# EAGLE schematic GuageSchematic (EAGLE 9.7.0)
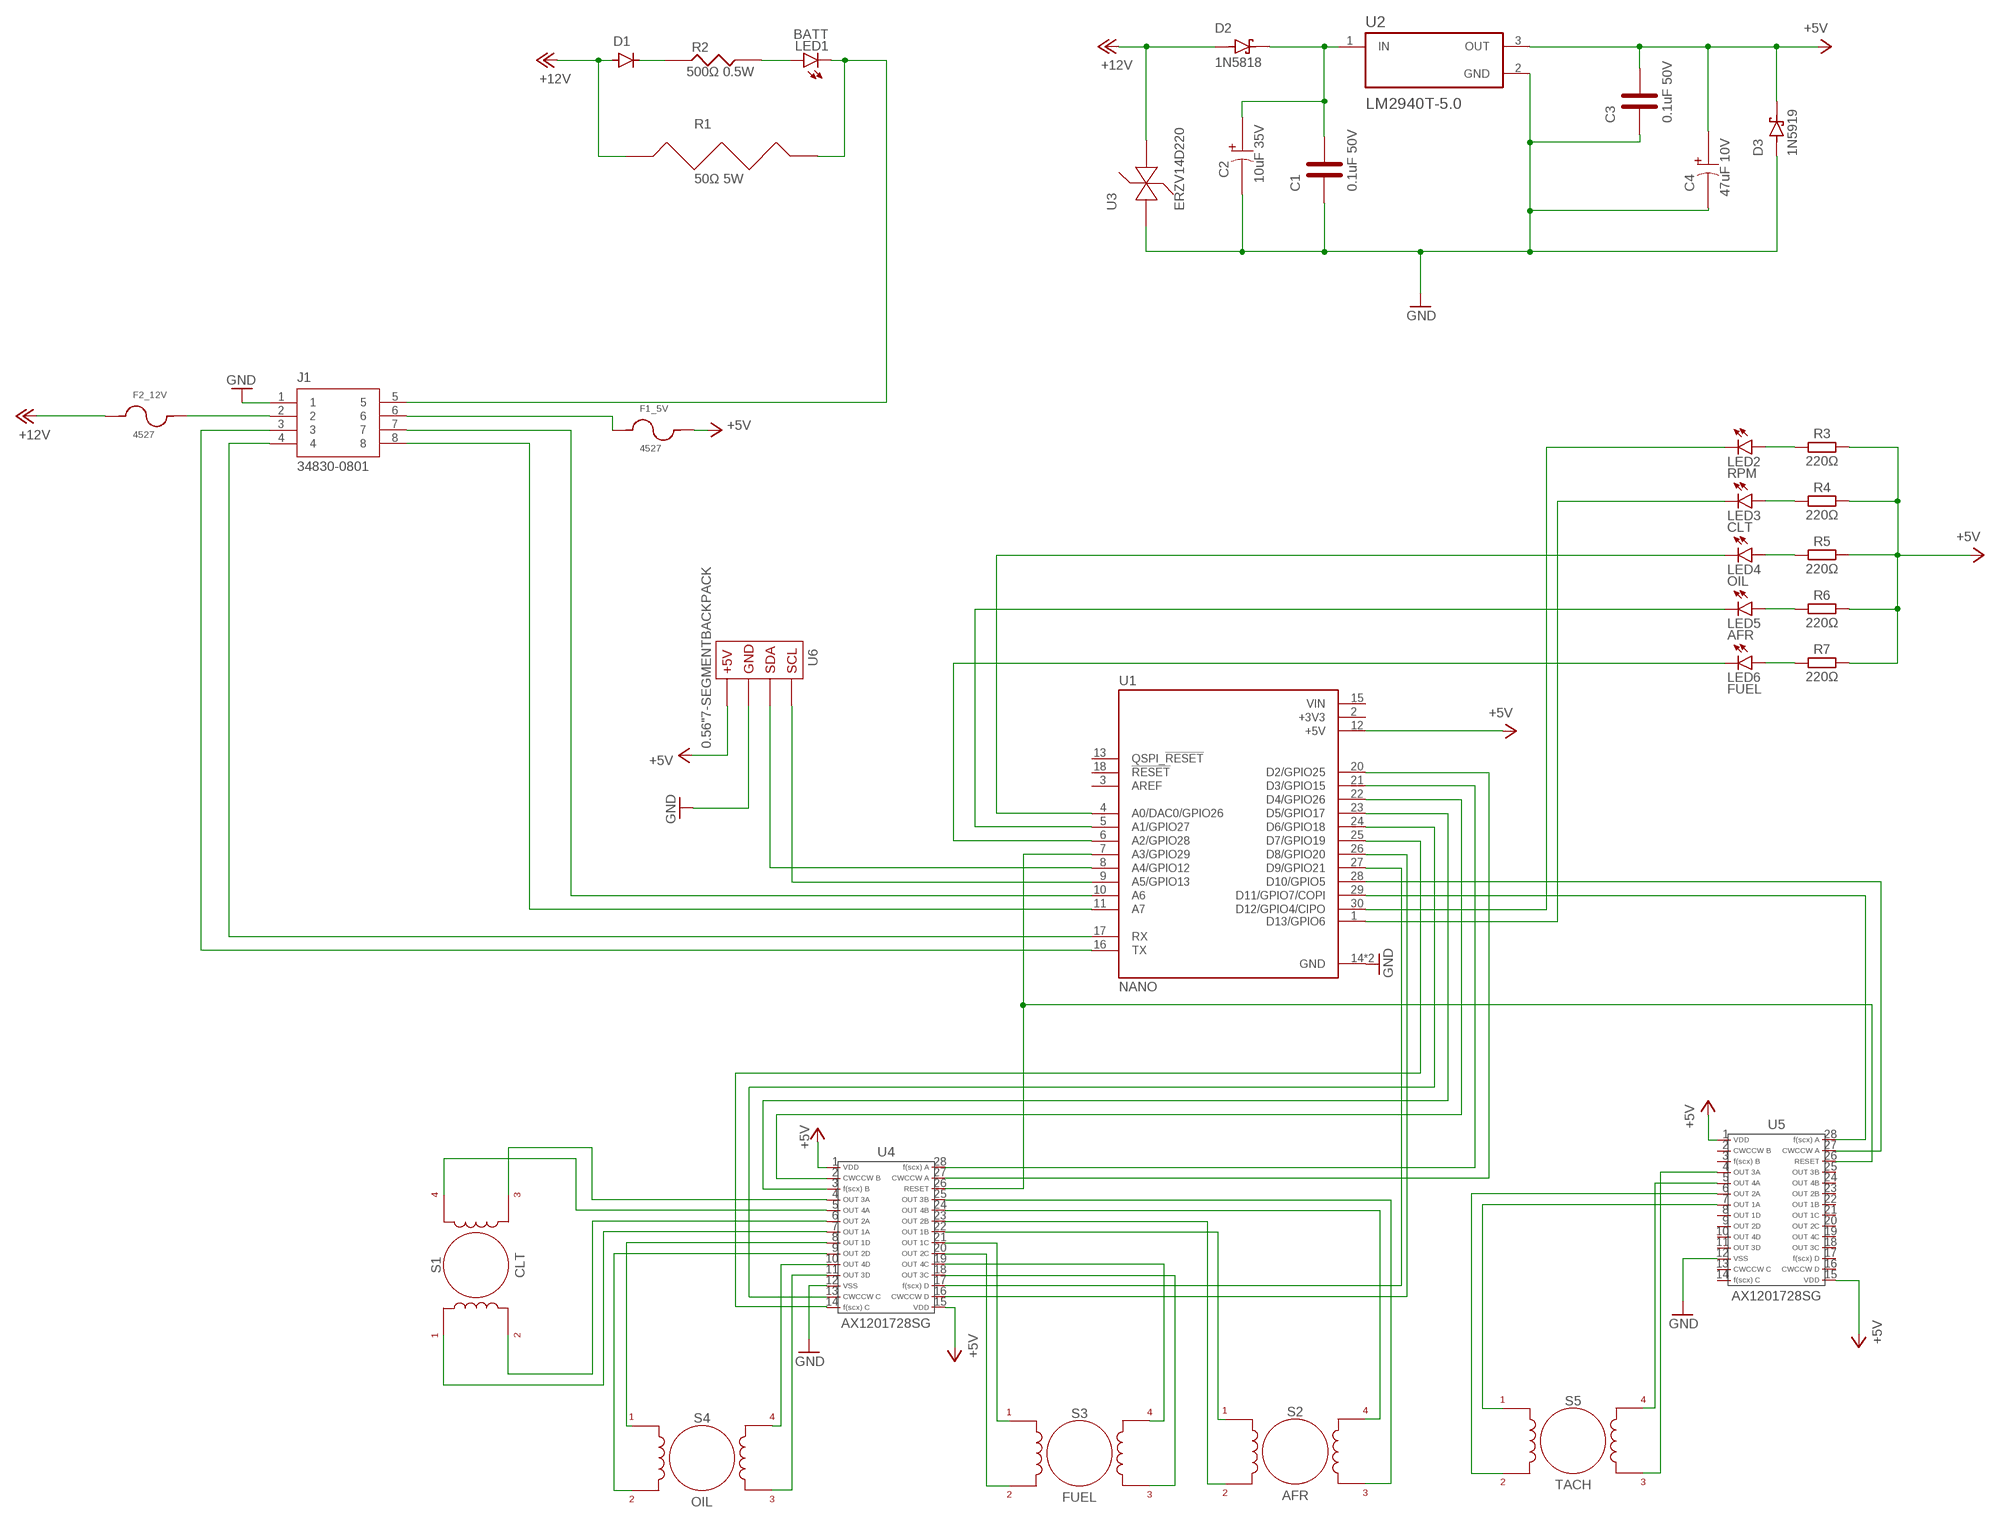
[diagram p0: schematic, sheet 1]

## Parts
C1  0.1uF 50V  C322C104K5R5TA  [C322C104K5R5TA]
C2  10uF 35V  T356G106K035AT  [T356G106K035AT]
C3  0.1uF 50V  C322C104K5R5TA  [C322C104K5R5TA]
C4  47uF 10V  TAP476K006CCS  [TAP476K006CCS]
D1  1N4004  [DO-41]
D2  1N5818  [DIOAD1036W78L520D271]
D3  1N5919  1N5818  [DIOAD1036W78L520D271]
F1_5V  4527  [4527]
F2_12V  4527  [4527]
J1  34830-0801  [MOLEX_34830-0801]
LED1  BATT  LED5MM  [LED5MM]
LED2  RPM  LED5MM  [LED5MM]
LED3  CLT  LED5MM  [LED5MM]
LED4  OIL  LED5MM  [LED5MM]
LED5  AFR  LED5MM  [LED5MM]
LED6  FUEL  LED5MM  [LED5MM]
R1  50Ω 5W  25J50RE  [25J50RE]
R2  500Ω 0.5W  CMF55  [CMF55]
R3  220Ω  R_AXIAL-7.2MM-PITCH  [RESAD724W46L381D178B]
R4  220Ω  R_AXIAL-7.2MM-PITCH  [RESAD724W46L381D178B]
R5  220Ω  R_AXIAL-7.2MM-PITCH  [RESAD724W46L381D178B]
R6  220Ω  R_AXIAL-7.2MM-PITCH  [RESAD724W46L381D178B]
R7  220Ω  R_AXIAL-7.2MM-PITCH  [RESAD724W46L381D178B]
S1  CLT  X27.168  [X27.168]
S2  AFR  X27.168  [X27.168]
S3  FUEL  X27.168  [X27.168]
S4  OIL  X27.168  [X27.168]
S5  TACH  X27.168  [X27.168]
U1  NANO  ABX00053  [MODULE_ABX00053]
U2  LM2940T-5.0  [TO254P1054X470X1955-3]
U3  ERZV14D220  [ERZV14D220]
U4  AX1201728SG  [AX1201728SG]
U5  AX1201728SG  [AX1201728SG]
U6  0.56"7-SEGMENTBACKPACK  [0.56"7-SEGMENTBACKPACK]

## Nets
+5V: C3.2 C4.1 D3.K F1_5V.2 R3.2 R4.2 R5.2 R6.2 R7.2 U1.12(+5V) U2.3(OUT) U4.1 U4.15 U5.1 U5.15 U6.P$4
+12V: D1.A D2.A F2_12V.1 R1.1 U3.2
GND: C1.1 C2.2 C3.1 C4.2 D3.A J1.1 U1.14(GND) U1.19(GND) U2.2(GND) U3.1 U4.12 U5.12 U6.P$3
N$1: J1.3 U1.16(TX)
N$2: J1.4 U1.17(RX)
N$3: J1.7 U1.10(A6)
N$4: J1.8 U1.11(A7)
N$5: D1.C R2.1
N$6: LED1.A R2.2
N$7: J1.5 LED1.K(C) R1.2
N$8: C1.2 C2.1 D2.K U2.1(IN)
N$9: F1_5V.1 J1.6
N$10: F2_12V.2 J1.2
N$11: U1.7(A3/GPIO29) U4.26 U5.26
N$12: U1.20(D2/GPIO25) U4.27
N$13: U1.21(D3/GPIO15) U4.28
N$14: U1.22(D4/GPIO26) U4.2
N$15: U1.23(D5/GPIO17) U4.3
N$16: U1.24(D6/GPIO18) U4.13
N$17: U1.25(D7/GPIO19) U4.14
N$18: U1.26(D8/GPIO20) U4.16
N$19: U1.27(D9/GPIO21) U4.17
N$20: U1.28(D10/GPIO5) U5.27
N$21: U1.29(D11/GPIO7/COPI) U5.28
N$22: LED2.A R3.1
N$23: LED3.A R4.1
N$24: LED4.A R5.1
N$25: LED5.A R6.1
N$26: LED6.A R7.1
N$27: LED2.K(C) U1.30(D12/GPIO4/CIPO)
N$28: LED3.K(C) U1.1(D13/GPIO6)
N$29: LED4.K(C) U1.4(A0/DAC0/GPIO26)
N$30: LED5.K(C) U1.5(A1/GPIO27)
N$31: LED6.K(C) U1.6(A2/GPIO28)
N$32: S1.P$1 U4.7
N$33: S1.P$2 U4.6
N$34: S1.P$3 U4.4
N$35: S1.P$4 U4.5
N$36: S5.P$1 U5.7
N$37: S5.P$2 U5.6
N$38: S5.P$3 U5.4
N$39: S5.P$4 U5.5
N$40: S4.P$1 U4.8
N$41: S4.P$2 U4.9
N$42: S4.P$3 U4.11
N$43: S4.P$4 U4.10
N$44: S3.P$3 U4.18
N$45: S3.P$4 U4.19
N$46: S3.P$2 U4.20
N$47: S3.P$1 U4.21
N$48: S2.P$1 U4.22
N$49: S2.P$2 U4.23
N$50: S2.P$4 U4.24
N$51: S2.P$3 U4.25
N$52: U1.8(A4/GPIO12) U6.P$2
N$53: U1.9(A5/GPIO13) U6.P$1
Unconnected: U1.3(AREF) U1.13(QSPI_!RESET) U1.18(!RESET) U5.2 U5.3 U5.8 U5.9 U5.10 U5.11 U5.13 U5.14 U5.16 U5.17 U5.18 U5.19 U5.20 U5.21 U5.22 U5.23 U5.24 U5.25

## Power pins joined to a net without a drawn wire
+3V3: U1.2(+3V3)
VIN: U1.15(VIN)

## Library data of the parts
C1 C3 = GaugesPCB:C322C104K5R5TA
C2 = GaugesPCB:T356G106K035AT
C4 = GaugesPCB:TAP476K006CCS
D1 = Diodes:1N4004: DIODE GEN PURP 400V 1A DO41 Manufacturer's datasheet <https://www.mccsemi.com/pdf/Products/1N4001-1N4007(DO-41).pdf>; CREATED_BY: PCBLayout.com; DIGIKEY_PART_NUMBER: 1N4004MSCT-ND; MANUFACTURER: Micro Commercial Co; MPN: 1N4004; PACKAGE: DO-41
D2 D3 = 1N5818:1N5818: Diode Schottky 30V 1A Through Hole DO-204AL (DO-41) Check availability <https://pricing.snapeda.com/parts/1N5818/STMicroelectronics/view-part?ref=eda>; AVAILABILITY: In Stock; DESCRIPTION: Diode Schottky 30 V 1A Through Hole DO-41; MF: STMicroelectronics; MP: 1N5818; PACKAGE: DO-41 STMicroelectronics; PRICE: None; PURCHASE-URL: https://pricing.snapeda.com/search/part/1N5818/?ref=eda
F1_5V F2_12V = Fuse Holder:4527: FUSE HLDR CARTRIDGE 250V 5A PCB Manufacturer's datasheet <https://www.keyelco.com/userAssets/file/M65p44.pdf>; CREATED_BY: PCBLayout.com; DIGIKEY_PN: 36-4527-ND; MANUFACTURER: Keystone Electronics; MPN: 4527
J1 = 34830-0801:34830-0801: MX150™ 2x4 Dual Row Right Angle Header, 8 Circuits, Polarization A, Black, Solder Tail Check availability <https://pricing.snapeda.com/parts/34830-0801/Molex/view-part?ref=eda>; AVAILABILITY: In Stock; DESCRIPTION: Connector Header Through Hole, Right Angle 8 position 0.138 (3.50mm); MF: Molex; MP: 34830-0801; PACKAGE: None; PRICE: None; PURCHASE-URL: https://pricing.snapeda.com/search/part/34830-0801/?ref=eda
LED1-LED6 = led:LED: LED OSRAM: - CHIPLED LG R971, LG N971, LY N971, LG Q971, LY Q971, LO R971, LY R971 LH N974, LH R974 LS Q976, LO Q976, LY Q976 LO Q996 - Hyper CHIPLED LW Q18S LB Q993, LB Q99A, LB R99A - SideLED LS A670, LO A670, LY A670, LG A670, LP A670 LB A673, LV A673, LT A673, LW A673 LH A674 LY A675 LS A676, LA A676, LO A676, LY A676, LW A676 LS A679, LY A679, LG A679 - Hyper Micro SIDELED® LS Y876, LA Y876, LO Y876, LY Y876 LT Y87S - SmartLED LW L88C, LW L88S LB L89C, LB L89S, LG L890 LS L89K, LO L89K, LY L89K LS L896, LA L896, LO L896, LY L896 - TOPLED LS T670, LO T670, LY T670, LG T670, LP T670 LSG T670, LSP T670, LSY T670, LOP T670, LYG T670 LG T671, LOG T671, LSG T671 LB T673, LV T673, LT T673, LW T673 LH T674 LS T676, LA T676, LO T676, LY T676, LB T676, LH T676, LSB T676, LW T676 LB T67C, LV T67C, LT T67C, LS T67K, LO T67K, LY T67K, LW E67C LS E67B, LA E67B, LO E67B, LY E67B, LB E67C, LV E67C, LT E67C LW T67C LS T679, LY T679, LG T679 LS T770, LO T770, LY T770, LG T770, LP T770 LB T773, LV T773, LT T773, LW T773 LH T774 LS E675, LA E675, LY E675, LS T675 LS T776, LA T776, LO T776, LY T776, LB T776 LHGB T686 LT T68C, LB T68C - Hyper Mini TOPLED® LB M676 - Mini TOPLED Santana® LG M470 LS M47K, LO M47K, LY M47K Source: http://www.osram.convergy.de LUXEON: - LUMILED® LXK2-PW12-R00, LXK2-PW12-S00, LXK2-PW14-U00, LXK2-PW14-V00 LXK2-PM12-R00, LXK2-PM12-S00, LXK2-PM14-U00 LXK2-PE12-Q00, LXK2-PE12-R00, LXK2-PE12-S00, LXK2-PE14-T00, LXK2-PE14-U00 LXK2-PB12-K00, LXK2-PB12-L00, LXK2-PB12-M00, LXK2-PB14-N00, LXK2-PB14-P00, LXK2-PB14-Q00 LXK2-PR12-L00, LXK2-PR12-M00, LXK2-PR14-Q00, LXK2-PR14-R00 LXK2-PD12-Q00, LXK2-PD12-R00, LXK2-PD12-S00 LXK2-PH12-R00, LXK2-PH12-S00 LXK2-PL12-P00, LXK2-PL12-Q00, LXK2-PL12-R00 Source: www.luxeon.com KINGBRIGHT: KA-3528ASYC Source: www.kingbright.com
R1 = GaugesPCB:25J50RE
R2 = GaugesPCB:CMF55
R3-R7 = Resistor:R: Resistor Fixed - Generic; CATEGORY: Resistor; SUB-CATEGORY: Fixed
S1-S5 = GaugesPCB:X27.168
U1 = Arduino Nano:ABX00053: ARDUINO NANO RP2040 CONNECT WITH Check availability <https://pricing.snapeda.com/parts/ABX00053/Arduino/view-part?ref=eda>; AVAILABILITY: In Stock; DESCRIPTION: NINA-W102, RP2040 Arduino Nano RP2040 Connect with Headers series ARM® Cortex®-M0+ MCU 32-Bit Embedded Evaluation Board; MF: Arduino; MP: ABX00053; PACKAGE: None; PRICE: None; PURCHASE-URL: https://pricing.snapeda.com/search/part/ABX00053/?ref=eda
U2 = LM2940T-5.0:LM2940T-5.0: Check availability <https://pricing.snapeda.com/parts/LM2940T-5.0/Texas%20Instruments/view-part?ref=eda>; AVAILABILITY: In Stock; DESCRIPTION: 1-A, 26-V, high-PSRR, low-dropout voltage regulator 3-TO-220 -40 to 125; MF: Texas Instruments; MP: LM2940T-5.0; PACKAGE: TO-220-3 Texas Instruments; PRICE: None; PURCHASE-URL: https://pricing.snapeda.com/search/part/LM2940T-5.0/?ref=eda
U3 = GaugesPCB:ERZV14D220
U4 U5 = GaugesPCB:AX1201728SG
U6 = GaugesPCB:0.56"7-SEGMENTBACKPACK